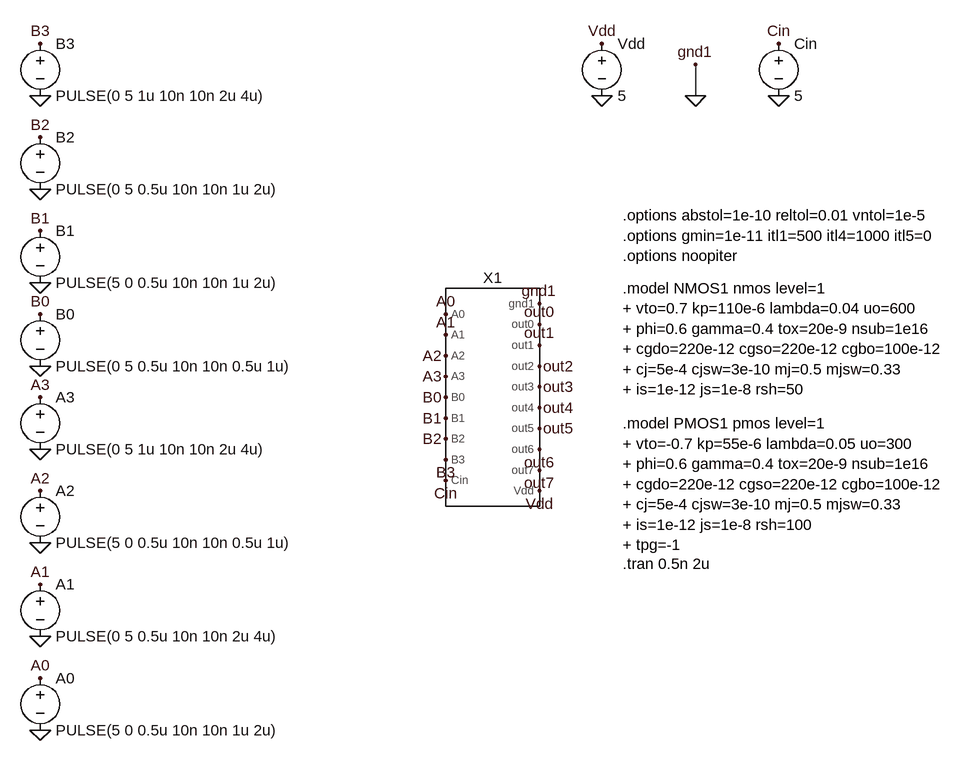
[diagram p0: schematic AddSub_TB.asc]
AddSub_TB.asc, the LTspice schematic file:
Version 4.1
SHEET 1 1516 724
WIRE 1072 -272 1072 -320
FLAG 64 -272 0
FLAG 64 16 0
FLAG 64 144 0
FLAG 64 272 0
FLAG 64 416 0
FLAG 64 560 0
FLAG 64 704 0
FLAG 928 -272 0
FLAG 1072 -272 0
FLAG 1072 -320 gnd1
FLAG 1200 -272 0
FLAG 64 624 A0
FLAG 64 480 A1
FLAG 64 336 A2
FLAG 64 192 A3
FLAG 64 64 B0
FLAG 64 -64 B1
FLAG 64 -208 B2
FLAG 64 -352 B3
FLAG 1200 -352 Cin
FLAG 64 -128 0
FLAG 688 64 A0
FLAG 688 96 A1
FLAG 688 128 A2
FLAG 688 160 A3
FLAG 688 192 B0
FLAG 688 224 B1
FLAG 688 256 B2
FLAG 688 288 B3
FLAG 688 320 Cin
FLAG 832 80 out0
FLAG 832 112 out1
FLAG 832 144 out2
FLAG 832 176 out3
FLAG 832 208 out4
FLAG 832 240 out5
FLAG 832 272 out6
FLAG 832 304 out7
FLAG 832 336 Vdd
FLAG 832 48 gnd1
FLAG 928 -352 Vdd
SYMBOL AddSub 752 192 R0
SYMATTR InstName X1
SYMBOL voltage 64 608 R0
SYMATTR InstName A0
SYMATTR Value PULSE(5 0 0.5u 10n 10n 1u 2u)
SYMBOL voltage 64 464 R0
SYMATTR InstName A1
SYMATTR Value PULSE(0 5 0.5u 10n 10n 2u 4u)
SYMBOL voltage 64 320 R0
SYMATTR InstName A2
SYMATTR Value PULSE(5 0 0.5u 10n 10n 0.5u 1u)
SYMBOL voltage 64 176 R0
SYMATTR InstName A3
SYMATTR Value PULSE(0 5 1u 10n 10n 2u 4u)
SYMBOL voltage 64 48 R0
SYMATTR InstName B0
SYMATTR Value PULSE(0 5 0.5u 10n 10n 0.5u 1u)
SYMBOL voltage 64 -80 R0
SYMATTR InstName B1
SYMATTR Value PULSE(5 0 0.5u 10n 10n 1u 2u)
SYMBOL voltage 64 -224 R0
SYMATTR InstName B2
SYMATTR Value PULSE(0 5 0.5u 10n 10n 1u 2u)
SYMBOL voltage 64 -368 R0
SYMATTR InstName B3
SYMATTR Value PULSE(0 5 1u 10n 10n 2u 4u)
SYMBOL voltage 928 -368 R0
SYMATTR InstName Vdd
SYMATTR Value 5
SYMBOL voltage 1200 -368 R0
WINDOW 123 0 0 Left 0
WINDOW 39 0 0 Left 0
SYMATTR InstName Cin
SYMATTR Value 5
TEXT 960 24 Left 2 !.model NMOS1 nmos level=1\n+ vto=0.7 kp=110e-6 lambda=0.04 uo=600\n+ phi=0.6 gamma=0.4 tox=20e-9 nsub=1e16\n+ cgdo=220e-12 cgso=220e-12 cgbo=100e-12\n+ cj=5e-4 cjsw=3e-10 mj=0.5 mjsw=0.33\n+ is=1e-12 js=1e-8 rsh=50
TEXT 960 232 Left 2 !.model PMOS1 pmos level=1\n+ vto=-0.7 kp=55e-6 lambda=0.05 uo=300\n+ phi=0.6 gamma=0.4 tox=20e-9 nsub=1e16\n+ cgdo=220e-12 cgso=220e-12 cgbo=100e-12\n+ cj=5e-4 cjsw=3e-10 mj=0.5 mjsw=0.33\n+ is=1e-12 js=1e-8 rsh=100\n+ tpg=-1
TEXT 960 448 Left 2 !.tran 0.5n 2u
TEXT 960 -88 Left 2 !.options abstol=1e-10 reltol=0.01 vntol=1e-5\n.options gmin=1e-11 itl1=500 itl4=1000 itl5=0\n.options noopiter

The netlist it stands for:
* AddSub_TB.asc
X§X1 A0 A1 A2 A3 B0 B1 B2 B3 Cin 0 out0 out1 out2 out3 out4 out5 out6 out7 Vdd AddSub  ; pins A0 A1 A2 A3 B0 B1 B2 B3 Cin gnd1 out0 out1 out2 out3 out4 out5 out6 out7 Vdd
V§A0 A0 0 PULSE(5 0 0.5u 10n 10n 1u 2u)
V§A1 A1 0 PULSE(0 5 0.5u 10n 10n 2u 4u)
V§A2 A2 0 PULSE(5 0 0.5u 10n 10n 0.5u 1u)
V§A3 A3 0 PULSE(0 5 1u 10n 10n 2u 4u)
V§B0 B0 0 PULSE(0 5 0.5u 10n 10n 0.5u 1u)
V§B1 B1 0 PULSE(5 0 0.5u 10n 10n 1u 2u)
V§B2 B2 0 PULSE(0 5 0.5u 10n 10n 1u 2u)
V§B3 B3 0 PULSE(0 5 1u 10n 10n 2u 4u)
Vdd Vdd 0 5
V§Cin Cin 0 5
.model NMOS1 nmos level=1
+ vto=0.7 kp=110e-6 lambda=0.04 uo=600
+ phi=0.6 gamma=0.4 tox=20e-9 nsub=1e16
+ cgdo=220e-12 cgso=220e-12 cgbo=100e-12
+ cj=5e-4 cjsw=3e-10 mj=0.5 mjsw=0.33
+ is=1e-12 js=1e-8 rsh=50
.model PMOS1 pmos level=1
+ vto=-0.7 kp=55e-6 lambda=0.05 uo=300
+ phi=0.6 gamma=0.4 tox=20e-9 nsub=1e16
+ cgdo=220e-12 cgso=220e-12 cgbo=100e-12
+ cj=5e-4 cjsw=3e-10 mj=0.5 mjsw=0.33
+ is=1e-12 js=1e-8 rsh=100
+ tpg=-1
.tran 0.5n 2u
.options abstol=1e-10 reltol=0.01 vntol=1e-5
.options gmin=1e-11 itl1=500 itl4=1000 itl5=0
.options noopiter
.backanno
.end